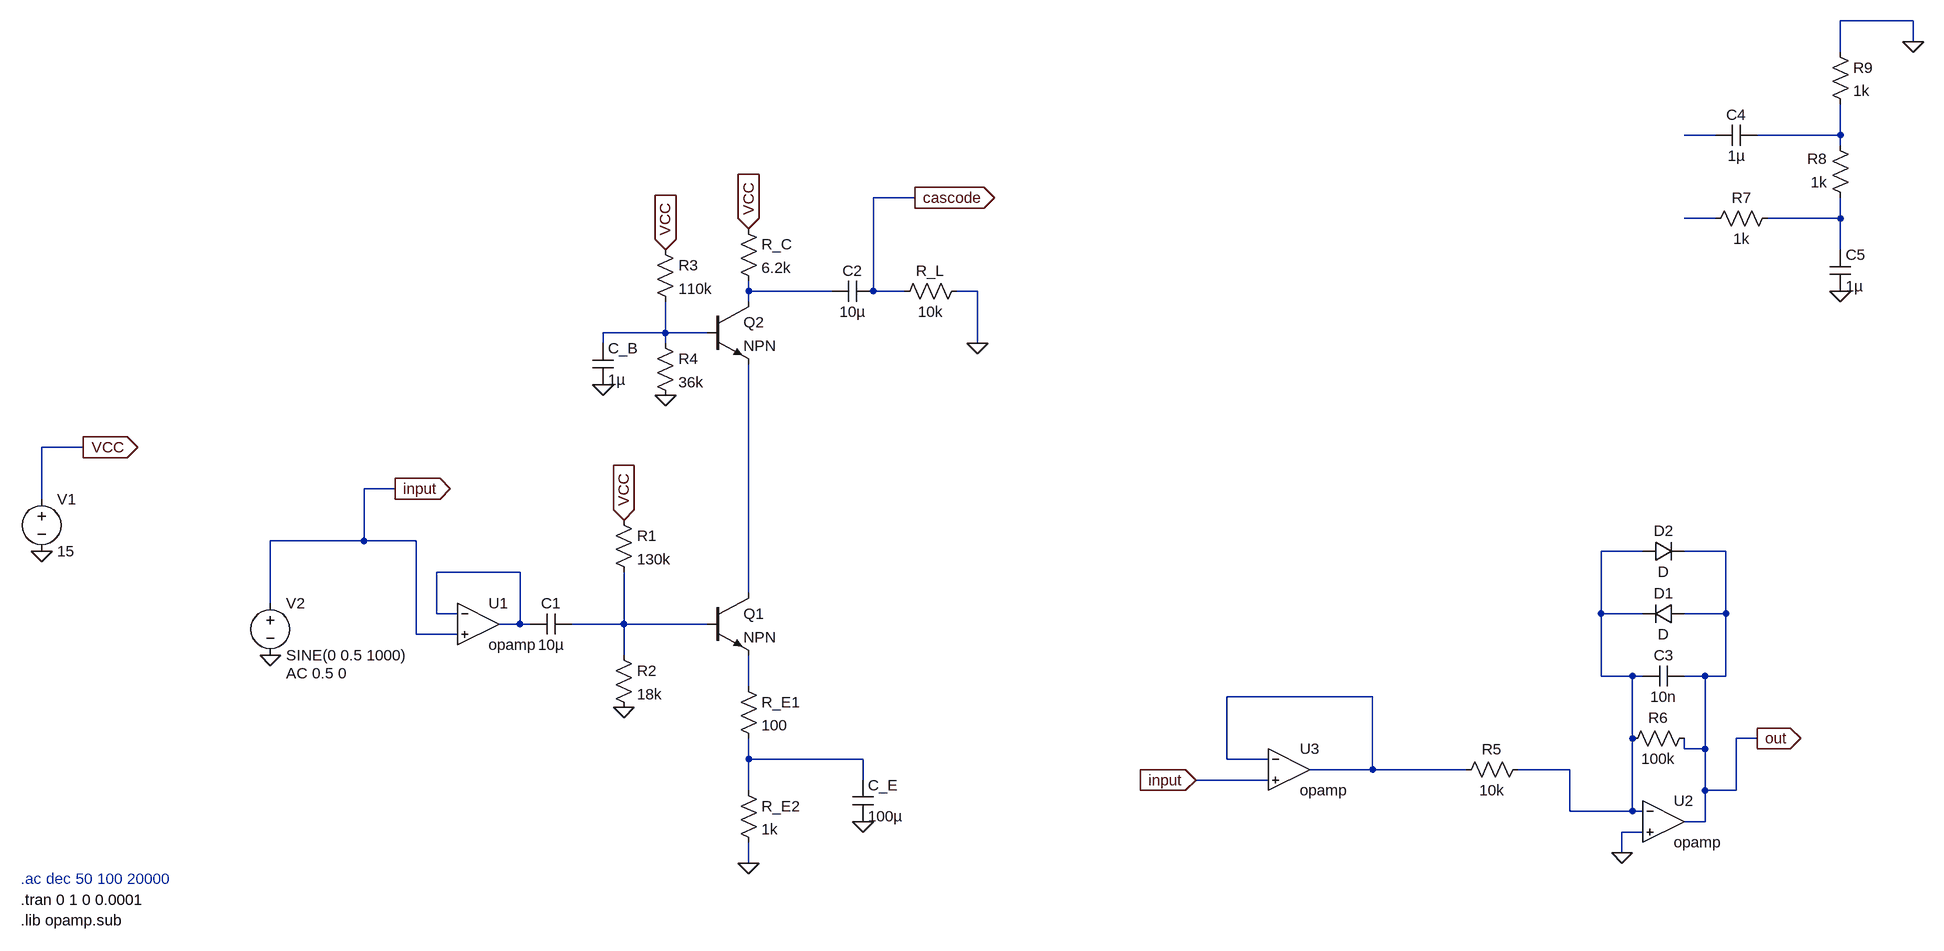
[diagram p0: schematic Overdrive.asc]
Overdrive.asc, the LTspice schematic file:
Version 4.1
SHEET 1 2308 680
WIRE 2288 -848 2176 -848
WIRE 2288 -816 2288 -848
WIRE 2176 -800 2176 -848
WIRE 1984 -672 1936 -672
WIRE 2176 -672 2176 -720
WIRE 2176 -672 2048 -672
WIRE 2176 -656 2176 -672
WIRE 752 -576 688 -576
WIRE 1984 -544 1936 -544
WIRE 2176 -544 2176 -576
WIRE 2176 -544 2064 -544
WIRE 2176 -496 2176 -544
WIRE 496 -432 496 -448
WIRE 624 -432 496 -432
WIRE 688 -432 688 -576
WIRE 736 -432 688 -432
WIRE 848 -432 816 -432
WIRE 496 -416 496 -432
WIRE 368 -368 368 -416
WIRE 368 -368 272 -368
WIRE 432 -368 368 -368
WIRE 272 -352 272 -368
WIRE 368 -352 368 -368
WIRE 848 -352 848 -432
WIRE -528 -192 -592 -192
WIRE -48 -128 -96 -128
WIRE -592 -112 -592 -192
WIRE -96 -48 -96 -128
WIRE -96 -48 -240 -48
WIRE -16 -48 -96 -48
WIRE 1872 -32 1808 -32
WIRE 2000 -32 1936 -32
WIRE 144 0 16 0
WIRE 496 32 496 -320
WIRE -240 48 -240 -48
WIRE 16 64 16 0
WIRE 48 64 16 64
WIRE 1808 64 1808 -32
WIRE 1872 64 1808 64
WIRE 2000 64 2000 -32
WIRE 2000 64 1936 64
WIRE 144 80 144 0
WIRE 144 80 112 80
WIRE 160 80 144 80
WIRE 304 80 304 0
WIRE 304 80 224 80
WIRE 432 80 304 80
WIRE -16 96 -16 -48
WIRE 48 96 -16 96
WIRE 304 128 304 80
WIRE 1808 160 1808 64
WIRE 1856 160 1808 160
WIRE 1872 160 1856 160
WIRE 1968 160 1936 160
WIRE 2000 160 2000 64
WIRE 2000 160 1968 160
WIRE 496 176 496 128
WIRE 1456 192 1232 192
WIRE 1856 256 1856 160
WIRE 2048 256 2016 256
WIRE 1936 272 1936 256
WIRE 1968 272 1968 160
WIRE 1968 272 1936 272
WIRE 496 288 496 256
WIRE 672 288 496 288
WIRE 1232 288 1232 192
WIRE 1296 288 1232 288
WIRE 1456 304 1456 192
WIRE 1456 304 1360 304
WIRE 1600 304 1456 304
WIRE 1760 304 1680 304
WIRE 672 320 672 288
WIRE 1296 320 1184 320
WIRE 496 336 496 288
WIRE 1968 336 1968 272
WIRE 2016 336 2016 256
WIRE 2016 336 1968 336
WIRE 1760 368 1760 304
WIRE 1856 368 1856 256
WIRE 1856 368 1760 368
WIRE 1872 368 1856 368
WIRE 1968 384 1968 336
WIRE 1968 384 1936 384
WIRE 1872 400 1840 400
WIRE 1840 432 1840 400
WIRE 496 448 496 416
FLAG 496 448 0
FLAG 304 208 0
FLAG -528 -192 VCC
IOPIN -528 -192 Out
FLAG -592 -32 0
FLAG 304 -80 VCC
IOPIN 304 -80 In
FLAG 272 -288 0
FLAG 368 -272 0
FLAG 368 -496 VCC
IOPIN 368 -496 In
FLAG 496 -528 VCC
IOPIN 496 -528 In
FLAG -240 128 0
FLAG 672 384 0
FLAG 1840 432 0
FLAG 2176 -432 0
FLAG 2288 -816 0
FLAG 2048 256 out
IOPIN 2048 256 Out
FLAG -48 -128 input
IOPIN -48 -128 Out
FLAG 752 -576 cascode
IOPIN 752 -576 Out
FLAG 848 -352 0
FLAG 1184 320 input
IOPIN 1184 320 In
SYMBOL OpAmps\\opamp 80 16 R0
SYMATTR InstName U1
SYMBOL cap 224 64 R90
WINDOW 0 0 32 VBottom 2
WINDOW 3 32 32 VTop 2
SYMATTR InstName C1
SYMATTR Value 10µ
SYMBOL cap 624 -416 R270
WINDOW 0 32 32 VTop 2
WINDOW 3 0 32 VBottom 2
SYMATTR InstName C2
SYMATTR Value 10µ
SYMBOL res 288 -96 R0
SYMATTR InstName R1
SYMATTR Value 130k
SYMBOL res 288 112 R0
SYMATTR InstName R2
SYMATTR Value 18k
SYMBOL res 480 160 R0
SYMATTR InstName R_E1
SYMATTR Value 100
SYMBOL res 480 320 R0
SYMATTR InstName R_E2
SYMATTR Value 1k
SYMBOL npn 432 32 R0
SYMATTR InstName Q1
SYMBOL npn 432 -416 R0
SYMATTR InstName Q2
SYMBOL voltage -592 -128 R0
WINDOW 123 0 0 Left 0
WINDOW 39 0 0 Left 0
SYMATTR InstName V1
SYMATTR Value 15
SYMBOL cap 256 -352 R0
SYMATTR InstName C_B
SYMATTR Value 1µ
SYMBOL res 352 -368 R0
SYMATTR InstName R4
SYMATTR Value 36k
SYMBOL res 352 -512 R0
SYMATTR InstName R3
SYMATTR Value 110k
SYMBOL res 480 -544 R0
SYMATTR InstName R_C
SYMATTR Value 6.2k
SYMBOL voltage -240 32 R0
WINDOW 123 24 124 Left 2
WINDOW 39 0 0 Left 0
SYMATTR Value2 AC 0.5 0
SYMATTR InstName V2
SYMATTR Value SINE(0 0.5 1000)
SYMBOL cap 656 320 R0
SYMATTR InstName C_E
SYMATTR Value 100µ
SYMBOL res 832 -448 R90
WINDOW 0 0 56 VBottom 2
WINDOW 3 32 56 VTop 2
SYMATTR InstName R_L
SYMATTR Value 10k
SYMBOL OpAmps\\opamp 1904 320 R0
SYMATTR InstName U2
SYMBOL res 1952 240 R90
WINDOW 0 0 56 VBottom 2
WINDOW 3 32 56 VTop 2
SYMATTR InstName R6
SYMATTR Value 100k
SYMBOL cap 1936 144 R90
WINDOW 0 0 32 VBottom 2
WINDOW 3 32 32 VTop 2
SYMATTR InstName C3
SYMATTR Value 10n
SYMBOL diode 1936 48 R90
WINDOW 0 0 32 VBottom 2
WINDOW 3 32 32 VTop 2
SYMATTR InstName D1
SYMBOL diode 1872 -16 R270
WINDOW 0 32 32 VTop 2
WINDOW 3 0 32 VBottom 2
SYMATTR InstName D2
SYMBOL cap 2048 -688 R90
WINDOW 0 0 32 VBottom 2
WINDOW 3 32 32 VTop 2
SYMATTR InstName C4
SYMATTR Value 1µ
SYMBOL res 2080 -560 R90
WINDOW 0 0 56 VBottom 2
WINDOW 3 32 56 VTop 2
SYMATTR InstName R7
SYMATTR Value 1k
SYMBOL res 2192 -560 R180
WINDOW 0 36 76 Left 2
WINDOW 3 36 40 Left 2
SYMATTR InstName R8
SYMATTR Value 1k
SYMBOL res 2160 -816 R0
SYMATTR InstName R9
SYMATTR Value 1k
SYMBOL cap 2160 -496 R0
SYMATTR InstName C5
SYMATTR Value 1µ
SYMBOL OpAmps\\opamp 1328 240 R0
SYMATTR InstName U3
SYMBOL res 1696 288 R90
WINDOW 0 0 56 VBottom 2
WINDOW 3 32 56 VTop 2
SYMATTR InstName R5
SYMATTR Value 10k
TEXT -624 472 Left 2 ;.ac dec 50 100 20000
TEXT -624 536 Left 2 !.lib opamp.sub
TEXT -624 504 Left 2 !.tran 0 1 0 0.0001

The netlist it stands for:
* Overdrive.asc
X§U1 N008 input N008 opamp Aol=100K GBW=10Meg  ; pins invin noninvin out
C1 N010 N008 10µ
C2 N005 cascode 10µ
R1 VCC N010 130k
R2 N010 0 18k
R_E1 N011 N013 100
R_E2 N013 0 1k
Q1 N009 N010 N011 0 NPN
Q2 N005 N006 N009 0 NPN
V1 VCC 0 15
C_B N006 0 1µ
R4 N006 0 36k
R3 VCC N006 110k
R_C VCC N005 6.2k
V2 input 0 SINE(0 0.5 1000) AC 0.5 0
C_E N013 0 100µ
R_L 0 cascode 10k
X§U2 N007 0 out opamp Aol=100K GBW=10Meg  ; pins invin noninvin out
R6 out N007 100k
C3 out N007 10n
D1 out N007 D
D2 N007 out D
C4 N002 N001 1µ
R7 N004 N003 1k
R8 N004 N002 1k
R9 0 N002 1k
C5 N004 0 1µ
X§U3 N012 input N012 opamp Aol=100K GBW=10Meg  ; pins invin noninvin out
R5 N007 N012 10k
.model D D
.lib standard.dio
.model NPN NPN
.model PNP PNP
.lib standard.bjt
* .ac dec 50 100 20000
.lib opamp.sub
.tran 0 1 0 0.0001
.backanno
.end